# EAGLE design cap_probe (EAGLE 9.6.2)
DESIGNER: A.Jenerts; DONE: 27.04.22; PROJECT_TITLE: Augsnes mitruma sensora modulis; REV: 1.1
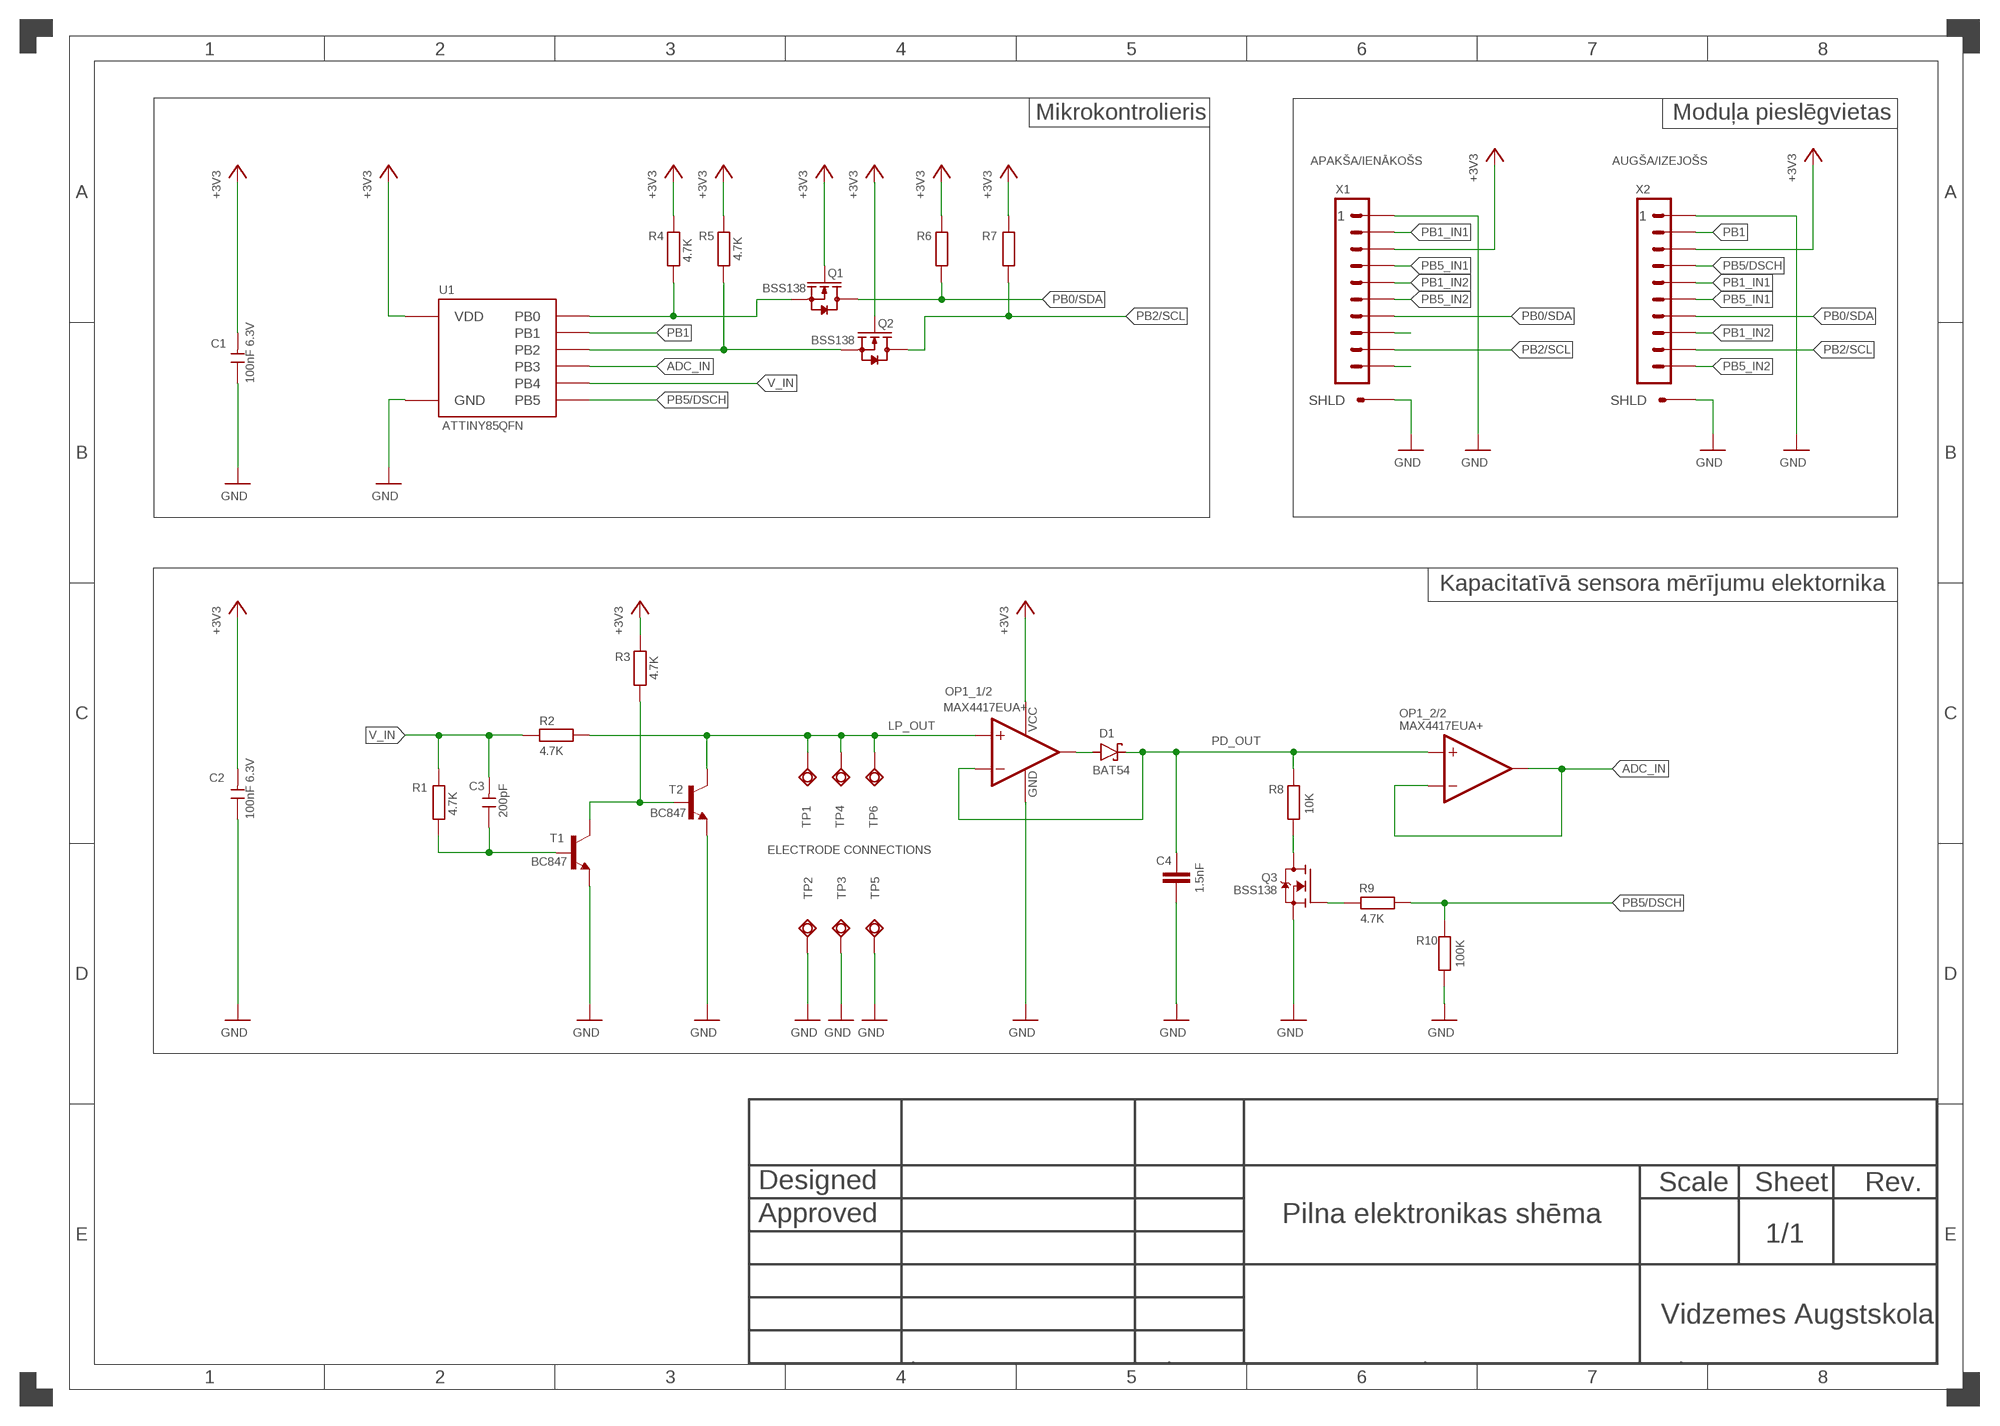
[diagram p0: schematic, sheet 1]

## Parts
C1  100nF 6.3V  CERAMIC-1UF-6.3V-10%-X5R(0402)  [C0402]
C2  100nF 6.3V  CERAMIC-1UF-6.3V-10%-X5R(0402)  [C0402]
C3  200pF  CERAMIC-1UF-6.3V-10%-X5R(0402)  [C0402]
C4  1.5nF  CAP_CERAMIC_0603  [SMD_0603C]
D1  BAT54  [SOT23]
OP1  MAX4417EUA+  MAX_OP_AMPUMAX  [SOT23-8]
Q1  BSS138  SMD-MOSFET-N-CH-50V-200MA-BSS138W-7-F(SOT-23)  [SOT-23]
Q2  BSS138  SMD-MOSFET-N-CH-50V-200MA-BSS138W-7-F(SOT-23)  [SOT-23]
Q3  BSS138  [SOT-23-3]
R1  4.7K  RESISTOR_0402  [R0402]
R2  4.7K  RESISTOR_0603  [SMD_0603]
R3  4.7K  RESISTOR_0402  [R0402]
R4  4.7K  RESISTOR_0402  [R0402]
R5  4.7K  RESISTOR_0402  [R0402]
R6  RESISTOR_0402  [R0402]
R7  RESISTOR_0402  [R0402]
R8  10K  RESISTOR_0402  [R0402]
R9  4.7K  RESISTOR_0402  [R0402]
R10  100K  RESISTOR_0402  [R0402]
T1  BC847  [SOT23]
T2  BC847  [SOT23]
TP1  PAD1.5X3.0  [PAD1.5X3.0]
TP2  PAD1.5X3.0  [PAD1.5X3.0]
TP3  PAD1.5X3.0  [PAD1.5X3.0]
TP4  PAD1.5X3.0  [PAD1.5X3.0]
TP5  PAD1.5X3.0  [PAD1.5X3.0]
TP6  PAD1.5X3.0  [PAD1.5X3.0]
U1  ATTINY85QFN  [QFN20_4X4]
X1  FFC_10PH  [FFC_1.0X10]
X2  FFC_10PH  [FFC_1.0X10]

## Nets
+3V3: C1.2 C2.2 OP1.P$8(V+) Q1.1(G) Q2.1(G) R3.2 R4.2 R5.2 R6.2 R7.2 U1.P$15(VDD) X1.P$3 X2.P$3
ADC_IN: OP1.P$6(_2/2:-IN) OP1.P$7(_2/2:OUT) U1.P$2(PB3)
GND: C1.1 C2.1 C4.2 OP1.P$4(V-) Q3.2(S) R10.2 T1.2(E) T2.2(E) TP2.P$1 TP3.P$1 TP5.P$1 U1.P$8(GND) U1.P$21(GND) X1.P$1 X1.P$11(SHLD) X1.P$12(SHLD) X2.P$1 X2.P$11(SHLD) X2.P$12(SHLD)
LP_OUT: OP1.P$3(_1/2:+IN) R2.2 T2.3(C) TP1.P$1 TP4.P$1 TP6.P$1
N$1: X1.P$10
N$2: C3.1 R1.1 T1.1(B)
N$3: D1.1(A) OP1.P$1(_1/2:OUT)
N$4: R3.1 T1.3(C) T2.1(B)
N$5: Q3.3(D) R8.1
N$6: Q3.1(G) R9.2
N$7: X1.P$8
PB0: Q1.2(S) R4.1 U1.P$11(PB0)
PB0/SDA: Q1.3(D) R6.1 X1.P$7 X2.P$7
PB1: U1.P$12(PB1) X2.P$2
PB1_IN1: X1.P$2 X2.P$5
PB1_IN2: X1.P$5 X2.P$8
PB2/SCL: Q2.3(D) R7.1 X1.P$9 X2.P$9
PB3: Q2.2(S) R5.1 U1.P$14(PB2)
PB5/DSCH: R9.1 R10.1 U1.P$1(PB5) X2.P$4
PB5_IN1: X1.P$4 X2.P$6
PB5_IN2: X1.P$6 X2.P$10
PD_OUT: C4.1 D1.3(C) OP1.P$2(_1/2:-IN) OP1.P$5(_2/2:+IN) R8.2
V_IN: C3.2 R1.2 R2.1 U1.P$5(PB4)

## Notes on the sheet
- Mikrokontrolieris | Moduļa pieslēgvietas
- APAKŠA/IENĀKOŠS | AUGŠA/IZEJOŠS
- Kapacitatīvā sensora mērījumu elektornika
- ELECTRODE CONNECTIONS
- Pilna elektronikas shēma
- Vidzemes Augstskola

## Library data of the parts
C1-C3 = Seeed-Capacitor:CERAMIC-1UF-6.3V-10%-X5R(0402): 302010003; MPN: CC0402KRX5R5BB105; VALUE: 1UF 6.3V
C4 = SIG_Parts:CAP_CERAMIC_*
D1 = diode:BAT54: Schottky Diodes Source: Fairchild .. BAT54.pdf
OP1 = SIG_Parts:MAX_OP_AMP
Q1 Q2 = Seeed-Transistor:SMD-MOSFET-N-CH-50V-200MA-BSS138W-7-F(SOT-23): 305030000; MPN: BSS138W-7-F; VALUE: BSS138W-7-F
Q3 = SIG_Parts:BSS138
R1-R10 = SIG_Parts:RESISTOR_*
T1 T2 = transistor:BC847: NPN TRANSISTOR
TP1-TP6 = SIG_Parts:PAD1.5X3.0
U1 = SIG_Parts:ATTINY85: The high-performance, low-power Microchip 8-bit AVR RISC-based microcontroller combines 8KB ISP flash memory, 512B EEPROM, 512-Byte SRAM, 6 general purpose I/O lines, 32 general purpose working registers, one 8-bit timer/counter with compare modes, one 8-bit high speed timer/counter, USI, internal and external Interrupts, 4-channel 10-bit A/D converter, programmable watchdog timer with internal oscillator, three software selectable power saving modes, and debugWIRE for on-chip debugging. The device achieves a throughput of 20 MIPS at 20 MHz and operates between 2.7-5.5 volts. https://www.microchip.com/wwwproducts/en/ATtiny85#datasheet-toggle
X1 X2 = SIG_Parts:FFC_10P

## Net classes
1 power: width 0.178 mm

## Board
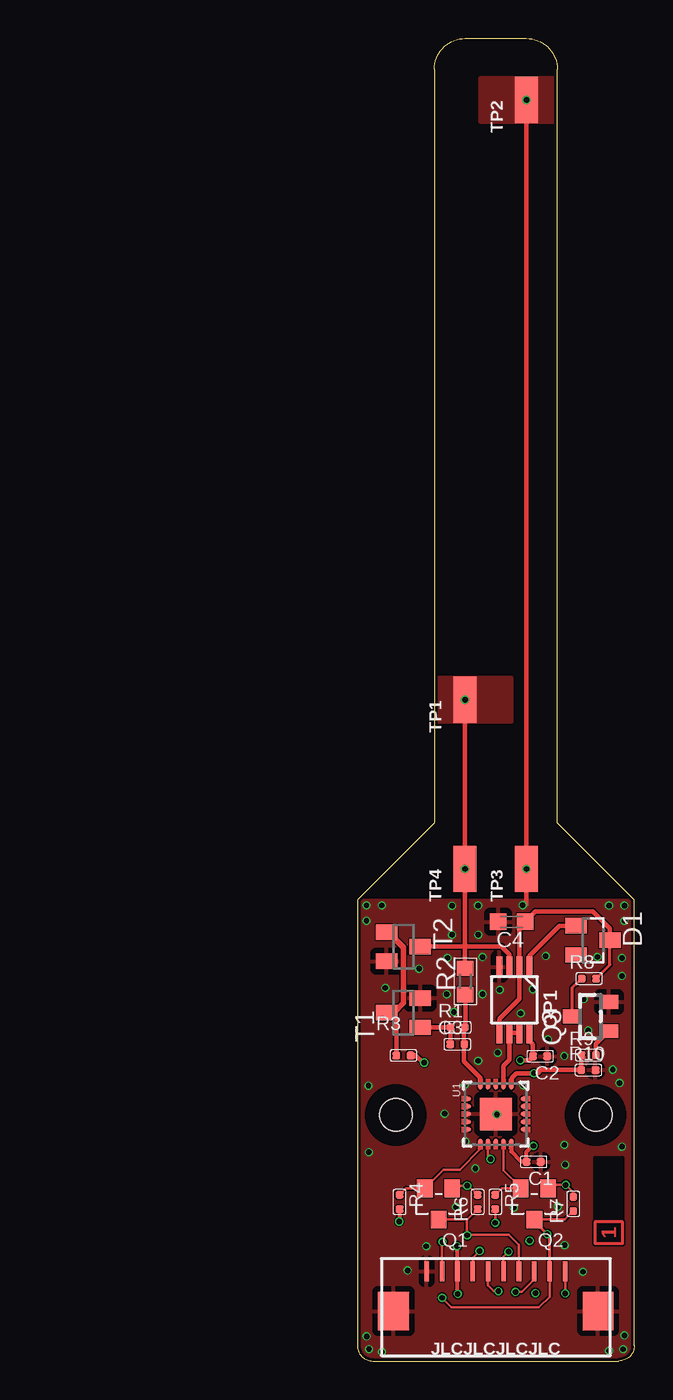
[diagram p1: board, top side]
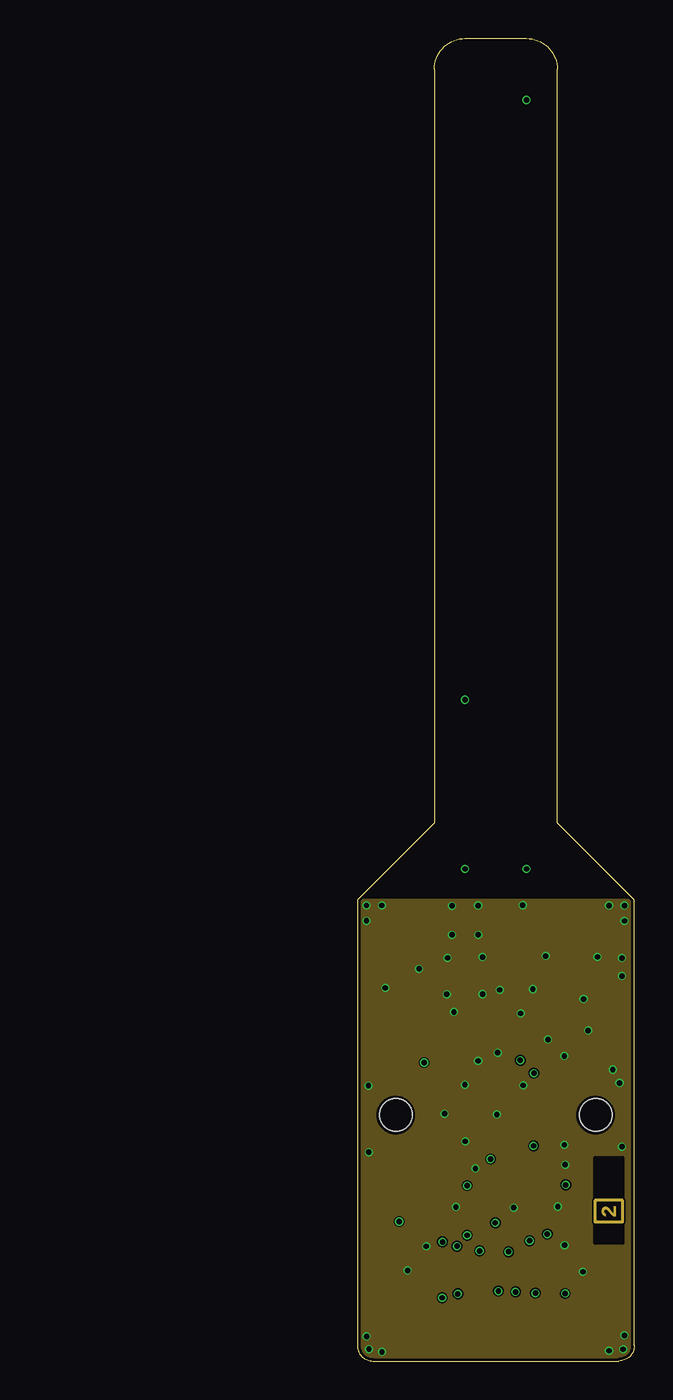
[diagram p2: board, inner layer Route2]
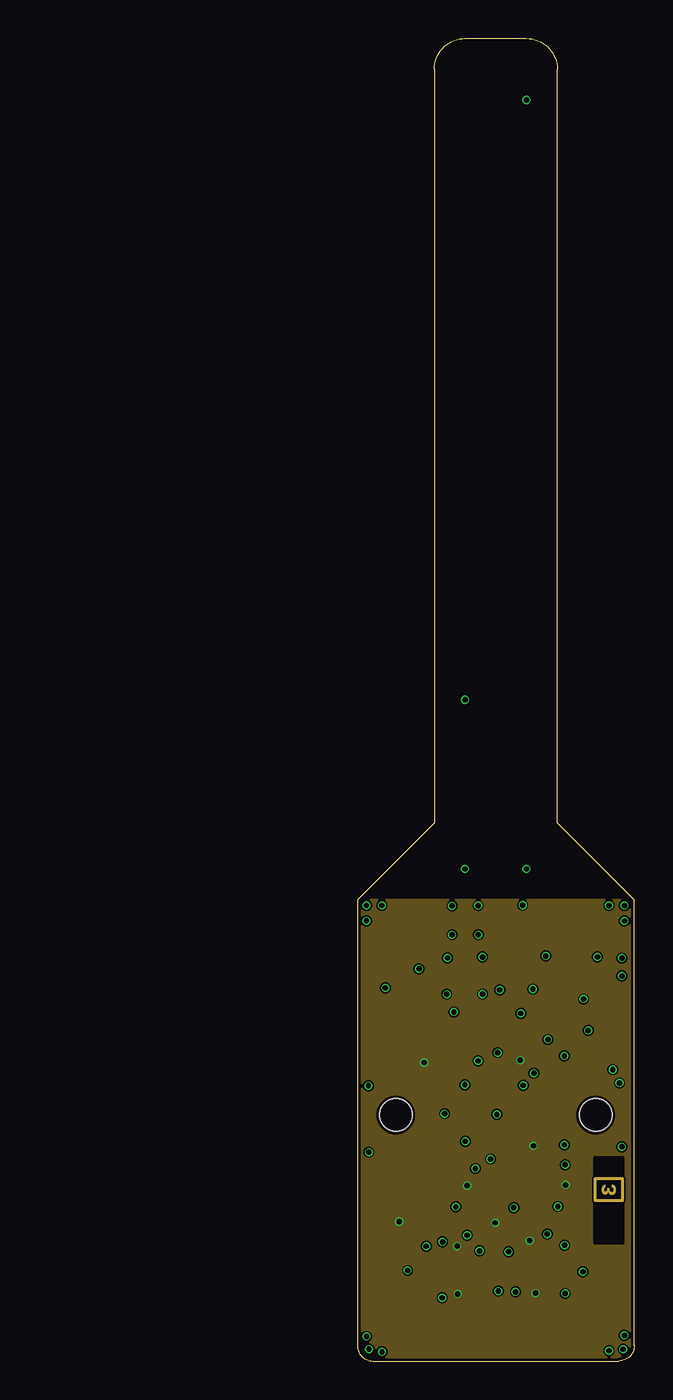
[diagram p3: board, inner layer Route3]
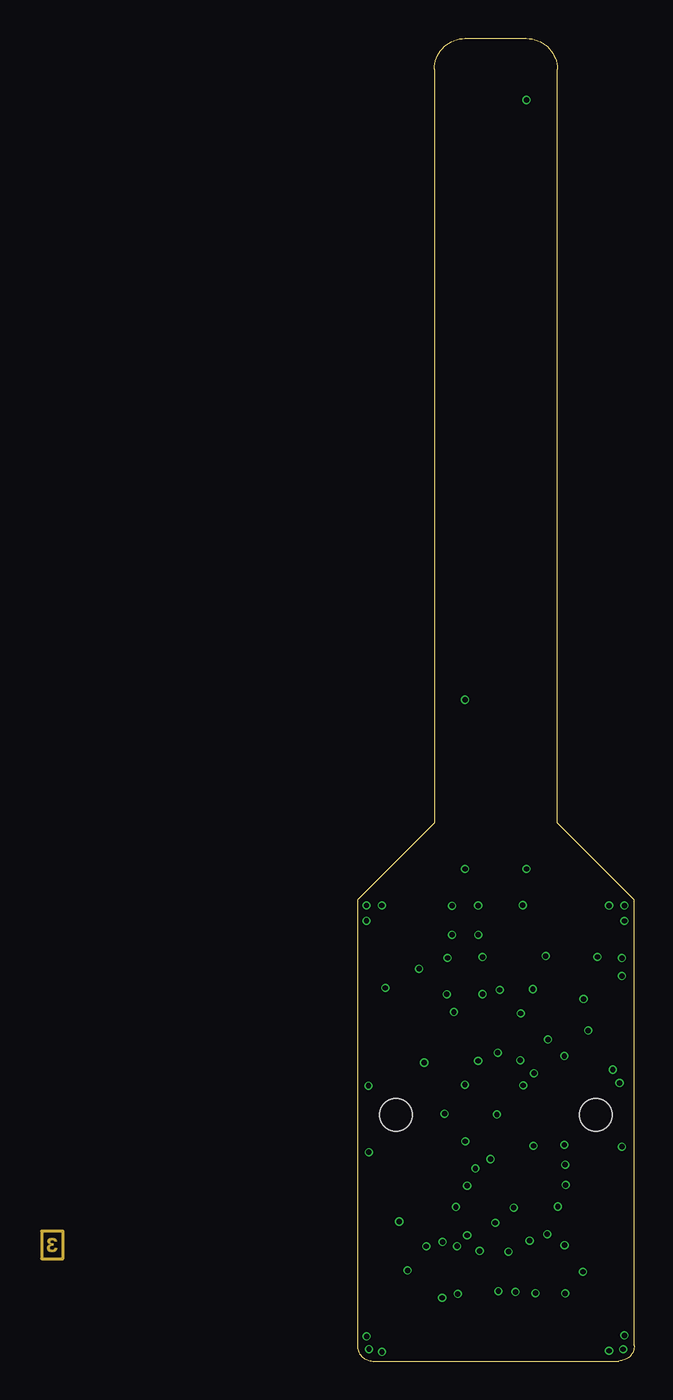
[diagram p4: board, inner layer Route15]
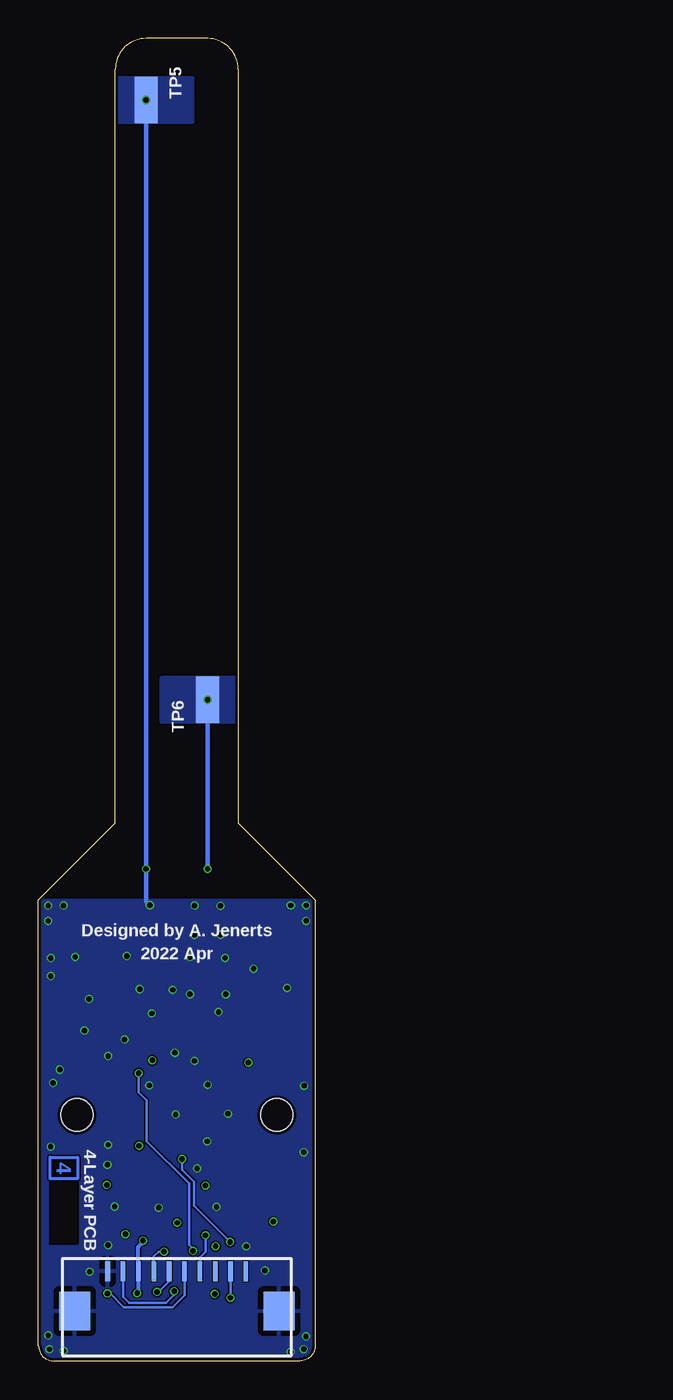
[diagram p5: board, bottom side, seen from below]

Size 18 x 86 mm. Coordinates in mm from the lower left corner, seen from the top.
Outline: 1,0 17,0 arc90 18,1 18,30 13,35 13,84 arc90 11,86 7,86 arc90 5,84 5,35 0,30 0,1 arc90 1,0
Copper layers (1+2*3+16): Top 0.035mm / dielectric 0.2mm / Route2 0.0175mm / dielectric 0.465mm / Route3 0.0175mm / dielectric 0.2mm / Bottom 0.035mm
Design rules "JLCPCB_4layer_7628_stck *": minimum track width 3.5mil, minimum drill 0.2mm, track to track 3.5mil, track to pad 3.5mil, pad to pad 3.5mil, via to via 3.5mil, smd to smd 0mil, copper to edge 0.2mm, drill to drill 6mil, minimum pad ring 3mil, minimum via ring 3mil, stop-mask expansion 4mil, vias tented up to drill 0.35mm, thermal gap 15mil
Holes 2.1 mm at 2.5,16 15.5,16
tRestrict: area 0.6,14.1 to 4.4,17.9; area 13.6,14.1 to 17.4,17.9
bRestrict: area 1.4,14.9 to 3.5,17.1; area 14.4,14.9 to 16.6,17.1

### Footprints (pad centres in the part's own frame; a part is rotated, then mirrored left to right if it is on the bottom)
C0402 = smd 0.5 x 0.5: 1 0,0.463; 2 0,-0.463
SMD_0603C = smd 1.05 x 1.08: 1 -0.875,0; 2 0.875,0
SOT23 = smd 1 x 1.4: 1 -0.95,-1.1; 2 0.95,-1.1; 3 0,1.1
SOT23-8 = smd 1.35 x 0.4: P$1 -2.15,0.975; P$2 -2.15,0.325; P$3 -2.15,-0.325; P$4 -2.15,-0.975; P$5 2.15,-0.975; P$6 2.15,-0.325; P$7 2.15,0.325; P$8 2.15,0.975
SOT-23 = smd 1.016 x 1.143: 1 -0.889,-1.016; 2 0.889,-1.016; 3 0,1.016
SOT-23-3 = smd 0.9 x 1.2: 1 -0.95,-1.2; 2 0.95,-1.2; 3 0,1.2
R0402 = smd 0.5 x 0.5: 1 0,0.463; 2 0,-0.463
SMD_0603 = smd 1 x 1.1: 1 -0.85,0; 2 0.85,0
PAD1.5X3.0 = smd 3 x 1.5: P$1 0,0
QFN20_4X4 = smd 0.4 x 0.3: P$1 -1.8,1; P$2 -1.8,0.5; P$3 -1.8,0; P$4 -1.8,-0.5; P$5 -1.8,-1; P$11 1.8,-1; P$12 1.8,-0.5; P$13 1.8,0; P$14 1.8,0.5; P$15 1.8,1 | smd 0.3 x 0.4: P$6 -1,-1.8; P$7 -0.5,-1.8; P$8 0,-1.8; P$9 0.5,-1.8; P$10 1,-1.8; P$16 1,1.8; P$17 0.5,1.8; P$18 0,1.8; P$19 -0.5,1.8; P$20 -1,1.8 | smd 2.1 x 2.1: P$21 0,0
FFC_1.0X10 = smd 0.3 x 1.3: P$1 -4.5,1.35; P$2 -3.5,1.35; P$3 -2.5,1.35; P$4 -1.5,1.35; P$5 -0.5,1.35; P$6 0.5,1.35; P$7 1.5,1.35; P$8 2.5,1.35; P$9 3.5,1.35; P$10 4.5,1.35 | smd 2 x 2.5: P$11 6.65,-1.25; P$12 -6.65,-1.25

### Placement (x,y rotation side)
C1  11.46,12.96 270 top
C2  11.88,19.82 270 top
C3  6.5,20.6 90 top
C4  10.03,28.56 180 top
D1  15.33,27.36 270 top
OP1  10.21,23.49 270 top
Q1  5.28,10.22 180 top
Q2  11.51,10.22 180 top
Q3  15.16,22.4 90 top
R1  6.53,21.7 90 top
R2  7.01,24.68 90 top
R3  3,19.87 90 top
R4  2.74,10.35 0 top
R5  8.96,10.35 0 top
R6  7.82,10.35 180 top
R7  14.04,10.22 180 top
R8  15.06,24.87 90 top
R9  15.05,19.89 90 top
R10  15.02,18.92 90 top
T1  3,22.65 90 top
T2  3,26.95 270 top
TP1  7,43 90 top
TP2  11,82 90 top
TP3  11,32 90 top
TP4  7,32 90 top
TP5  11,82 270 bottom
TP6  7,43 90 bottom
U1  9,16.06 270 top
X1  9,4.5 0 bottom
X2  9,4.5 0 top

### Tracks (layer width: path | path; a pad name or v marks a point on that pad's centre or on a via)
+3V2
  Route15 0.2: -20.55,6.65 -19.15,6.65 -19.15,8.45 -20.55,8.45 -20.55,6.65
+3V3  (via drill 0.35)
  Top 0.15: R5.2 v8.96,8.99 v8.97,8.99 | Q1.1 6.17,11.44 6.26,11.52 6.37,11.4 v7.14,11.4 7.22,11.4 R6.2 | R7.2 14.04,10.96 v13.55,11.45 12.61,11.45 Q2.1
  Top 0.25: v6.48,7.47 6.48,5.87 X2.P$3 6.5,4.4 v6.53,4.37 | U1.P$15 10,13.62 10.67,12.96 C1.2 11,13.62 11.38,13.99 v11.46,13.99 | R4.2 2.74,9.09 v2.72,9.07
  Top 0.3: OP1.P$8 11.18,20.85 11.42,20.61 C2.2 11.16,19.56 v10.59,19.56 | R3.2 3.79,19.87 4.25,19.41 v4.34,19.41
  Bottom 0.25: v11.2,7.82 11.2,7.72 11.5,7.42 X1.P$3 11.5,4.5 v11.58,4.42
  pour Route3: 0,-0.1 0,30 0,30 18,30 18,0 0.1,0
ADC_IN
  Top 0.3: OP1.P$6 OP1.P$7 | U1.P$2 9.5,19.2 9.88,19.58 OP1.P$6 | OP1.P$6
GND  (via drill 0.35)
  Top 0.3: 11,29.7 TP3.P$1 TP5.P$1
  Top 0.35: T1.2 4.1,23.36
  Bottom 0.3: TP5.P$1 TP3.P$1 11,29.89 v10.75,29.64
  other vias: 13.46,19.84 12.4,20.9 14.71,23.54 17.2,26.2 17.2,25.03 15.01,21.5 15.61,26.28 8.14,23.86 8.13,26.27 7.85,19.52 9.12,20.05 6.28,22.69 6.99,17.97 7.02,14.28 9.07,16.04 13.51,12.77 13.46,14.06 6.41,10.02 10.17,9.97 13.04,10.05 3.27,5.89 4.48,7.46 4.01,25.5 5.81,23.85 5.86,26.21 9.26,24.14 1.82,24.27 7.85,29.62 11.41,24.18 10.62,22.61 12.25,26.34 17.29,0.77 17.37,1.67 16.37,0.67 0.75,0.78 0.6,1.6 1.6,0.6 0.59,29.62 1.59,29.62 0.59,28.62 17.37,29.62 17.37,28.62 16.37,29.62 6.16,29.6 6.16,27.72 7.86,27.72 5.67,16.09 17.2,13.94 17.05,18.08 0.74,13.58 0.72,17.9 14.67,5.81 13.47,7.53 16.61,18.95 10.79,17.92 7.67,12.52 11,82 11,32
  pour Top: 0,0 0,30 18.1,30 18.1,0
  pour Route2: 0,-0.1 0,30 0,30 18,30 18,0 0.1,0
  pour Bottom: 0,0 0,30 18.1,30 18.1,0
  pour Top: 8,83.4 13,83.4 13,80.6 8,80.6
  pour Bottom: 8,83.4 13,83.4 13,80.6 8,80.6
GND/1
  Route3 0.2: 17.25,10.45 17.25,11.85 15.45,11.85 15.45,10.45 17.25,10.45
GND/4
  Top 0.2: 17.25,7.65 17.25,9.05 15.45,9.05 15.45,7.65 17.25,7.65
  Route2 0.2: 17.25,9.05 17.25,10.45 15.45,10.45 15.45,9.05 17.25,9.05
  Bottom 0.2: 17.25,11.85 17.25,13.25 15.45,13.25 15.45,11.85 17.25,11.85
LP_OUT  (via drill 0.35)
  Top 0.3: OP1.P$3 9.88,26.44 9.37,26.95 6.91,26.95 | 6.91,26.95 T2.3 | 6.99,26.88 6.99,27 6.91,26.93 6.91,26.95 | 6.99,26.88 6.99,25.55 R2.2 | 6.99,26.88 7,26.89 TP4.P$1 7,42
  Bottom 0.3: TP6.P$1 TP4.P$1
  other vias: 7,32 7,43
  pour Bottom: 5,44.4 10,44.4 10,41.6 5,41.6
  pour Top: 5,44.4 10,44.4 10,41.6 5,41.6
N$2
  Top 0.3: T1.1 | T1.1 R1.1 6.04,21.67 C3.1
N$3
  Top 0.3: OP1.P$1 11.18,26.34 13.14,28.31 D1.1
N$4
  Top 0.3: R3.1 2.53,21.6 2.53,22.15 2.03,22.65
  Top 0.35: T1.3 2.03,22.65 2.36,22.65 3,23.28 3,26.89 1.99,27.9 T2.1
N$5
  Top 0.2: R8.1 14.24,24.51 14.19,24.51 13.96,24.27 Q3.3
N$6
  Top 0.3: R9.2 15.51,20.63 16.33,21.45 Q3.1
N$8
  cutout Route3: 15.45,13.25 17.25,13.25 17.25,7.65 15.45,7.65
N$16
  cutout Route2: 15.45,13.25 17.25,13.25 17.25,7.65 15.45,7.65
  cutout Top: 15.45,13.25 17.25,13.25 17.25,7.65 15.45,7.65
  cutout Route15: -17.75,8.45 -17.75,6.65 -23.35,6.65 -23.35,8.45
  cutout Bottom: 15.45,13.25 17.25,13.25 17.25,7.65 15.45,7.65
PB0
  Top 0.15: R4.1 3.17,11.23 Q1.2 | Q1.2 5.61,12.45 6.66,12.45 8,13.79 U1.P$11 | 4.37,11.21 Q1.2
PB0/SDA  (via drill 0.35)
  Top 0.15: Q1.3 7.14,9.2 | 7.14,9.2 R6.1 | X2.P$7 10.5,7.56 9.86,8.2 7.16,8.2 v7.14,8.18 7.14,9.2
  Bottom 0.15: X1.P$7 7.5,6.75 7.14,7.11 v7.14,8.18
PB1  (via drill 0.35)
  Top 0.15: X2.P$2 5.5,7.71 v5.54,7.75 | v8.66,13.13 8.5,13.29 U1.P$12
  Bottom 0.15: v5.54,7.75 7.87,10.08 7.87,11.65 8.66,12.45 v8.66,13.13
PB1_IN1  (via drill 0.35)
  Top 0.15: v9.17,4.55 8.87,4.55 8.5,4.91 X2.P$5
  Bottom 0.15: X1.P$2 12.5,4.19 12.09,3.79 9.7,3.79 9.17,4.32 v9.17,4.55
PB1_IN2  (via drill 0.35)
  Top 0.15: v10.29,4.5 10.69,4.5 11.5,5.3 X2.P$8
  Bottom 0.15: X1.P$5 9.5,5.18 10.19,4.5 v10.29,4.5
PB2/SCL  (via drill 0.35)
  Top 0.15: Q2.3 13.49,9.2 R7.1 | X2.P$9 12.5,4.19 11.81,3.5 6.12,3.5 v5.51,4.12
  Top 0.2: X2.P$9 12.5,8.1 v12.34,8.26 11.51,9.09 Q2.3
  Bottom 0.15: v5.51,4.12 5.5,4.13 X1.P$9
PB3
  Top 0.15: R5.1 9.39,11.23 Q2.2 10.62,11.29 9.5,12.4 U1.P$14
PB5/DSCH  (via drill 0.35)
  Top 0.15: X2.P$4 7.5,6.71 v7.95,7.16
  Top 0.3: R9.1 14.55,19.89 14.56,19.88 R10.1 11.95,18.92 11.74,18.72 v11.48,18.72 10.34,18.72 10.03,18.41 10.03,17.89 U1.P$1
  Bottom 0.15: v7.95,7.16 7.95,7.3 8.21,7.55 8.21,11.56 10.95,14.3 10.95,16.94 11.48,17.48 v11.48,18.72
PB5_IN1  (via drill 0.35)
  Top 0.15: v9.83,7.11 9.5,6.78 X2.P$6
  Bottom 0.15: X1.P$4 10.5,6.8 10.19,7.11 v9.83,7.11
PB5_IN2  (via drill 0.35)
  Top 0.15: X2.P$10 13.51,5.84 v13.51,4.39
  Bottom 0.15: X1.P$6 8.5,4.28 9.27,3.5 12.45,3.5 13.34,4.39 v13.51,4.39
PD_OUT
  Top 0.2: R8.2 16.43,25.77 D1.3
  Top 0.3: OP1.P$5 9.23,22.24 10.53,23.54 OP1.P$2 10.53,28.26 10.83,28.56 C4.1 11.58,29.23 15.32,29.23 16.43,28.12 D1.3
V_IN
  Top 0.3: U1.P$5 8,18.42 6.93,19.48 6.93,20.63 | R2.1 7.01,21.72 R1.2 6.93,21.64 6.93,21 6.93,20.63 | C3.2 6.93,20.63

### Text on the board
Top: 1
Route2: 2
Route3: 3
Route15: 3
Bottom: 4
_tsilk: JLCJLCJLCJLC
_bsilk: Designed by A. Jenerts | 2022 Apr | 4-Layer PCB